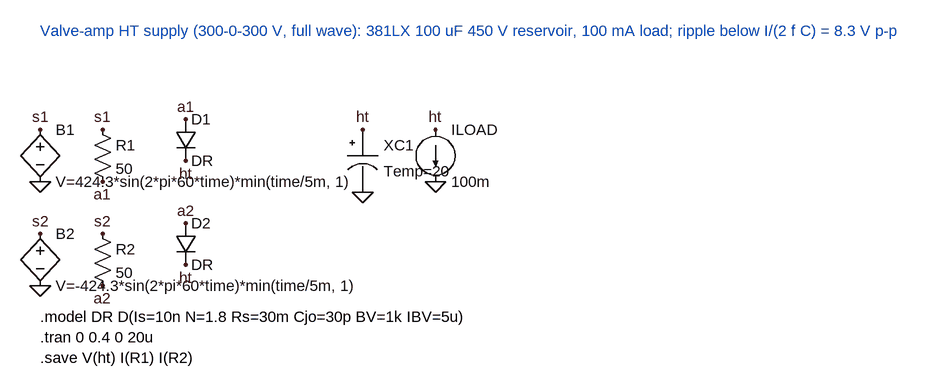
[diagram p0: schematic demo_ecap.asc]
demo_ecap.asc, the LTspice schematic file:
Version 4
SHEET 1 800 480
FLAG 0 112 s1
FLAG 0 192 0
FLAG 96 112 s1
FLAG 96 192 a1
FLAG 0 272 s2
FLAG 0 352 0
FLAG 96 272 s2
FLAG 96 352 a2
FLAG 224 96 a1
FLAG 224 160 ht
FLAG 224 256 a2
FLAG 224 320 ht
FLAG 496 112 ht
FLAG 496 208 0
FLAG 608 112 ht
FLAG 608 192 0
SYMBOL bv 0 96 R0
SYMATTR InstName B1
SYMATTR Value V=424.3*sin(2*pi*60*time)*min(time/5m, 1)
SYMBOL bv 0 256 R0
SYMATTR InstName B2
SYMATTR Value V=-424.3*sin(2*pi*60*time)*min(time/5m, 1)
SYMBOL res 80 96 R0
SYMATTR InstName R1
SYMATTR Value 50
SYMBOL res 80 256 R0
SYMATTR InstName R2
SYMATTR Value 50
SYMBOL diode 208 96 R0
SYMATTR InstName D1
SYMATTR Value DR
SYMBOL diode 208 256 R0
SYMATTR InstName D2
SYMATTR Value DR
SYMBOL 381LX101M450H022 480 96 R0
SYMATTR InstName XC1
SYMBOL current 608 112 R0
SYMATTR InstName ILOAD
SYMATTR Value 100m
TEXT 0 400 Left 2 !.model DR D(Is=10n N=1.8 Rs=30m Cjo=30p BV=1k IBV=5u)\n.tran 0 0.4 0 20u\n.save V(ht) I(R1) I(R2)
TEXT 0 -40 Left 2 ;Valve-amp HT supply (300-0-300 V, full wave): 381LX 100 uF 450 V reservoir, 100 mA load; ripple below I/(2 f C) = 8.3 V p-p

The netlist it stands for:
* demo_ecap.asc
B1 s1 0 V=424.3*sin(2*pi*60*time)*min(time/5m, 1)
B2 s2 0 V=-424.3*sin(2*pi*60*time)*min(time/5m, 1)
R1 s1 a1 50
R2 s2 a2 50
D1 a1 ht DR
D2 a2 ht DR
XXC1 ht 0 381LX101M450H022 Temp=20  ; pins P N
ILOAD ht 0 100m
.model D D
.lib standard.dio
.model DR D(Is=10n N=1.8 Rs=30m Cjo=30p BV=1k IBV=5u)
.tran 0 0.4 0 20u
.save V(ht) I(R1) I(R2)
* Valve-amp HT supply (300-0-300 V, full wave): 381LX 100 uF 450 V reservoir, 100 mA load; ripple below I/(2 f C) = 8.3 V p-p
.lib ecap.sub
.backanno
.end